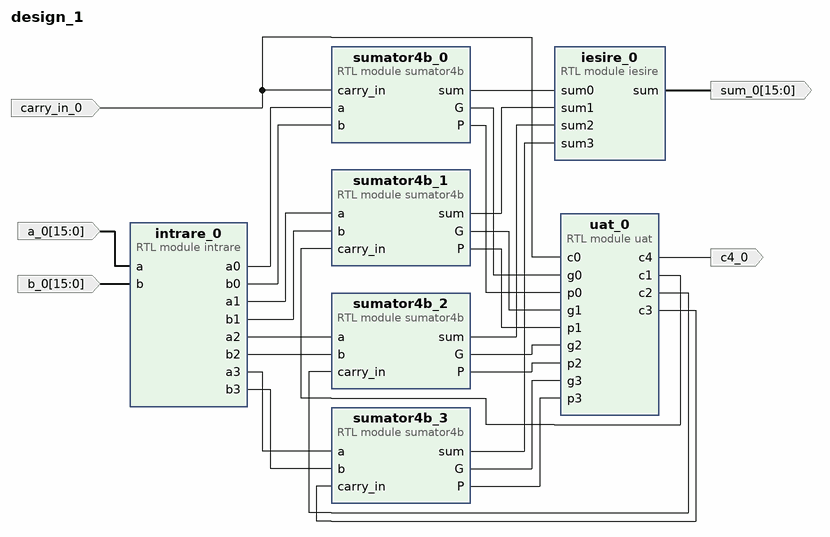
[diagram p0: block diagram of the top level]
# Vivado block design design_1, xc7a100tcsg324-1, Vivado 2022.1
create_bd_design design_1

create_bd_port -dir I carry_in_0
create_bd_port -dir O c4_0
create_bd_port -dir I -from 15 -to 0 a_0
create_bd_port -dir I -from 15 -to 0 b_0
create_bd_port -dir O -from 15 -to 0 sum_0

create_bd_cell -type module -reference sumator4b sumator4b_0
create_bd_cell -type module -reference sumator4b sumator4b_1
create_bd_cell -type module -reference sumator4b sumator4b_2
create_bd_cell -type module -reference sumator4b sumator4b_3
create_bd_cell -type module -reference uat uat_0
create_bd_cell -type module -reference intrare intrare_0
create_bd_cell -type module -reference iesire iesire_0

# ---- connections ----

connect_bd_net -net a_0_1 [get_bd_ports a_0] [get_bd_pins intrare_0/a]
connect_bd_net -net b_0_1 [get_bd_ports b_0] [get_bd_pins intrare_0/b]
connect_bd_net -net carry_in_0_1 [get_bd_ports carry_in_0] [get_bd_pins sumator4b_0/carry_in] [get_bd_pins uat_0/c0]
connect_bd_net [get_bd_pins iesire_0/sum] [get_bd_ports sum_0]
connect_bd_net [get_bd_pins intrare_0/a0] [get_bd_pins sumator4b_0/a]
connect_bd_net [get_bd_pins intrare_0/a1] [get_bd_pins sumator4b_1/a]
connect_bd_net [get_bd_pins intrare_0/a2] [get_bd_pins sumator4b_2/a]
connect_bd_net [get_bd_pins intrare_0/a3] [get_bd_pins sumator4b_3/a]
connect_bd_net [get_bd_pins intrare_0/b0] [get_bd_pins sumator4b_0/b]
connect_bd_net [get_bd_pins intrare_0/b1] [get_bd_pins sumator4b_1/b]
connect_bd_net [get_bd_pins intrare_0/b2] [get_bd_pins sumator4b_2/b]
connect_bd_net [get_bd_pins intrare_0/b3] [get_bd_pins sumator4b_3/b]
connect_bd_net [get_bd_pins sumator4b_0/G] [get_bd_pins uat_0/g0]
connect_bd_net [get_bd_pins sumator4b_0/P] [get_bd_pins uat_0/p0]
connect_bd_net [get_bd_pins sumator4b_0/sum] [get_bd_pins iesire_0/sum0]
connect_bd_net [get_bd_pins sumator4b_1/G] [get_bd_pins uat_0/g1]
connect_bd_net [get_bd_pins sumator4b_1/P] [get_bd_pins uat_0/p1]
connect_bd_net [get_bd_pins sumator4b_1/sum] [get_bd_pins iesire_0/sum1]
connect_bd_net [get_bd_pins sumator4b_2/G] [get_bd_pins uat_0/g2]
connect_bd_net [get_bd_pins sumator4b_2/P] [get_bd_pins uat_0/p2]
connect_bd_net [get_bd_pins sumator4b_2/sum] [get_bd_pins iesire_0/sum2]
connect_bd_net [get_bd_pins sumator4b_3/G] [get_bd_pins uat_0/g3]
connect_bd_net [get_bd_pins sumator4b_3/P] [get_bd_pins uat_0/p3]
connect_bd_net [get_bd_pins sumator4b_3/sum] [get_bd_pins iesire_0/sum3]
connect_bd_net [get_bd_pins uat_0/c1] [get_bd_pins sumator4b_1/carry_in]
connect_bd_net [get_bd_pins uat_0/c2] [get_bd_pins sumator4b_2/carry_in]
connect_bd_net [get_bd_pins uat_0/c3] [get_bd_pins sumator4b_3/carry_in]
connect_bd_net [get_bd_pins uat_0/c4] [get_bd_ports c4_0]

validate_bd_design
save_bd_design
